# Altium project PenguinPi.PrjPcb
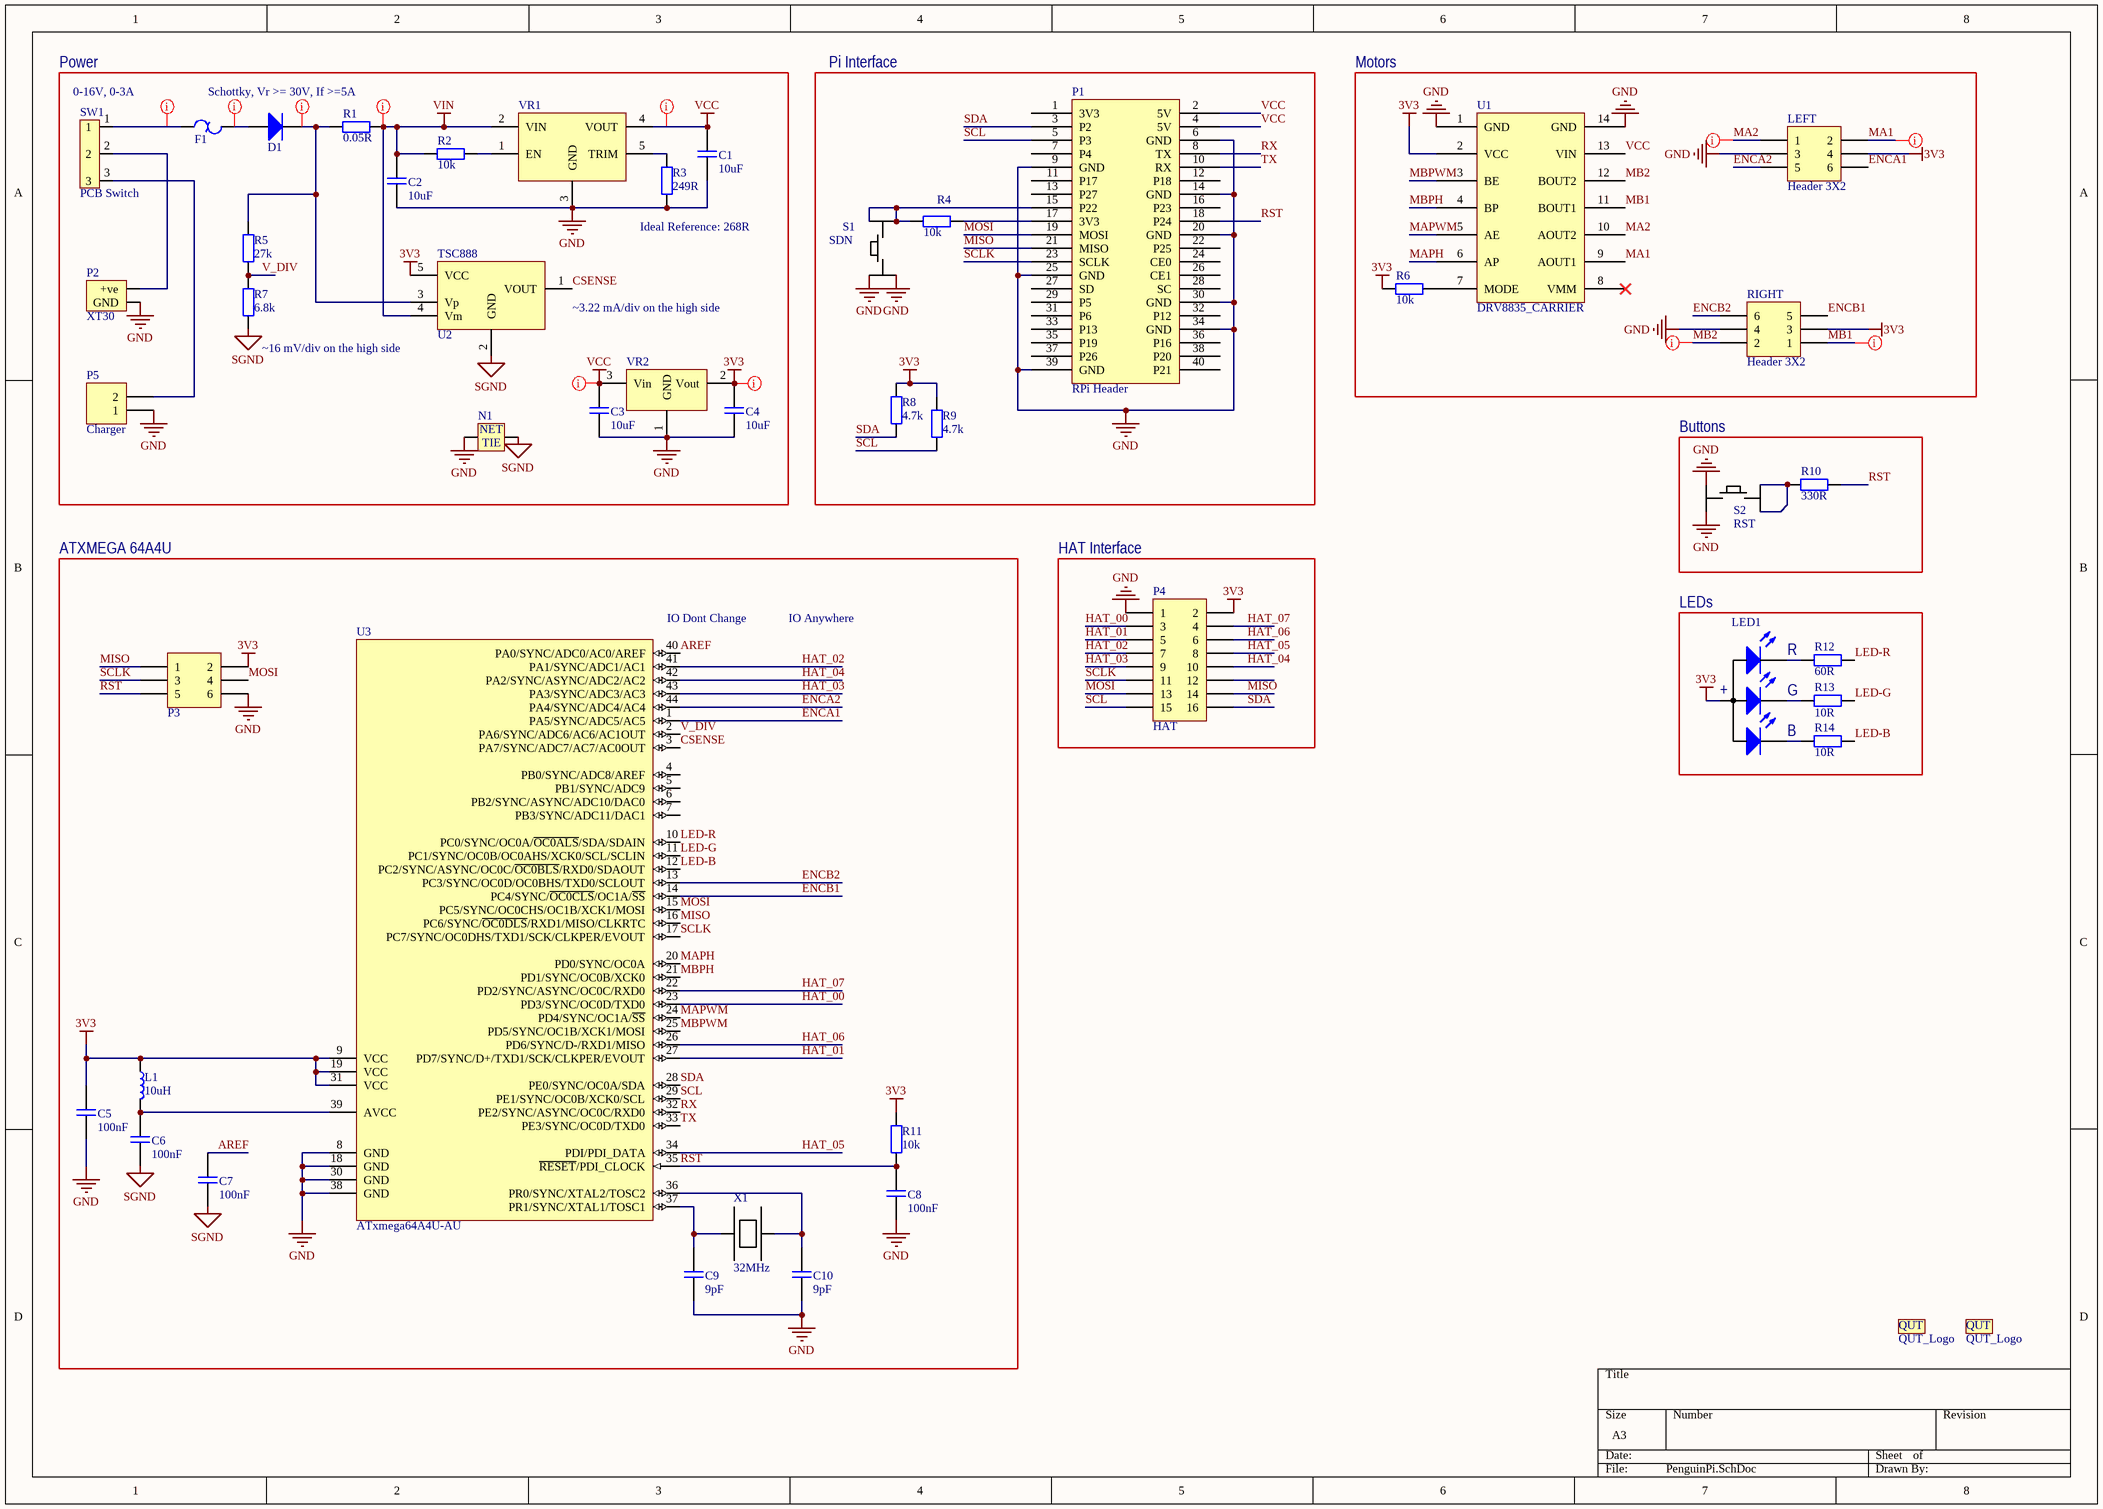
[diagram p0: PenguinPi.SchDoc]
1 sheet, 47 parts. Net scope: global (net labels, ports and power ports of the same name join across sheets).
Board file: PenguinPi.PcbDoc

## Sheet PenguinPi.SchDoc: PenguinPi v2
size A3; DrawnBy: Steven Bulmer; PageSetup: Record=PageOptions|CenterHorizontal=True|CenterVertical=True|PrintScale=1.01|XCorrection=1.00|YCorrection=1.00|PrintKind=1|BorderSize=5000000|LeftOffset=0|BottomOffset=0|Orientation=2|PaperLength=1000|PaperWidth=1000|Scale=100|PaperSource=7|PrintQuality=600|MediaType=1|DitherType=10|PrintScaleMode=1|PaperKind=A3 (297 x 420mm)|PaperIndex=8

### Parts
C1  value 10uF  [CAPC2012X07N]  (hidden comment: CAP SMD)
C2  value 10uF  [CAPC2012X07N]  (hidden comment: CAP SMD)
C3  value 10uF  [CAPC2012X07N]  (hidden comment: CAP SMD)
C4  value 10uF  [CAPC2012X07N]  (hidden comment: CAP SMD)
C5  value 100nF  [CAPC2012X07N]  (hidden comment: CAP SMD)
C6  value 100nF  [CAPC2012X07N]  (hidden comment: CAP SMD)
C7  value 100nF  [CAPC2012X07N]  (hidden comment: CAP SMD)
C8  value 100nF  [CAPC2012X07N]  (hidden comment: CAP SMD)
C9  value 9pF  [CAPC2012X07N]  (hidden comment: CAP SMD)
C10  value 9pF  [CAPC2012X07N]  (hidden comment: CAP SMD)
D1  SMD DIODE  [SODFL470X110-2N]  (value not drawn)
F1  RGEF250  [MF-MSMF250/16X-2]  (value not drawn)
L1  value 10uH  [CM322522]  (hidden comment: INDUCTOR SMD)
LED1  RGB SMD  [RGB SMD]  (value not drawn)
LEFT  Header 3X2  [HDR2X3]
LG1  QUT_Logo  [QUT_Logo]  (no BOM)
LG2  QUT_Logo  [QUT_Logo]  (no BOM)
N1  NETTIE  [NETTIE-SMD-5mil]  (value not drawn)  (net tie, no BOM)
P1  RPi Header  [RPI 2 Header]
P2  XT30  [XT30 - PCB mount]
P3  Header 3x2  [Header 3x2 nonstandard]  (value not drawn)
P4  HAT  [HDR2X8]
P5  Charger  [HDR1X2]
R1  value 0.05R  [RESC3216X06M]  (hidden comment: RES SMD)
R2  value 10k  [RESC2012X07N]  (hidden comment: RES SMD)
R3  value 249R  [RESC2012X07N]  (hidden comment: RES SMD)
R4  value 10k  [RESC2012X07N]  (hidden comment: RES SMD)
R5  value 27k  [RESC2012X07N]  (hidden comment: RES SMD)
R6  value 10k  [RESC2012X07N]  (hidden comment: RES SMD)
R7  value 6.8k  [RESC2012X07N]  (hidden comment: RES SMD)
R8  value 4.7k  [RESC2012X07N]  (hidden comment: RES SMD)
R9  value 4.7k  [RESC2012X07N]  (hidden comment: RES SMD)
R10  value 330R  [RESC2012X07N]  (hidden comment: RES SMD)
R11  value 10k  [RESC2012X07N]  (hidden comment: RES SMD)
R12  value 60R  [RESC2012X07N]  (hidden comment: RES SMD)
R13  value 10R  [RESC2012X07N]  (hidden comment: RES SMD)
R14  value 10R  [RESC2012X07N]  (hidden comment: RES SMD)
RIGHT  Header 3X2  [HDR2X3]
S1  SDN  [E-SWITCH-TL3342]
S2  RST  [E-SWITCH-TL3342]
SW1  PCB Switch  [PCB Switch]
U1  DRV8835_CARRIER  [DRV8835_CARRIER]
U2  TSC888  [SOT95P280X145-5N]
U3  ATxmega64A4U-AU  [44A_L]
VR1  MURATA_OKR-T3-W12C  [MURATA_OKR-Tn]  (value not drawn)
VR2  3V3 LDO  [SOT230P700X180-4N]  (value not drawn)
X1  32MHz  [XTAL AV Series]

### Blocks framed on the sheet
Power: C1-C4 D1 F1 N1 P2 P5 R1-R3 R5 R7 SW1 U2 VR1 VR2
Pi Interface: P1 R4 R8 R9 S1
Motors: LEFT R6 RIGHT U1
Buttons: R10 S2
ATXMEGA 64A4U: C5-C10 L1 P3 R11 U3 X1
HAT Interface: P4
LEDs: LED1 R12-R14

### Nets
3V3: C4.2(K) C5.2(K) L1.1(Anode) LED1.4(A) LEFT.4 P3.2 P4.2 R6.1 R8.2 R9.2 R11.2 RIGHT.3 U1.2(VCC) U2.5(VCC) U3.9(VCC) U3.19(VCC) U3.31(VCC) VR2.2(Vout)
GND: C1.1(A) C2.1(A) C3.1(A) C4.1(A) C5.1(A) C8.1(A) C9.1(A) C10.1(A) LEFT.3 N1.1 P1.6(GND) P1.9(GND) P1.14(GND) P1.20(GND) P1.25(GND) P1.30(GND) P1.34(GND) P1.39(GND) P2.1(GND) P3.6 P4.1 P5.1 R3.1 RIGHT.4 S1.3(B') S1.4(B) S2.1(A) S2.2(A') U1.1(GND) U1.14(GND) U3.8(GND) U3.18(GND) U3.30(GND) U3.38(GND) VR1.3(GND) VR2.1(GND)
SGND: C6.1(A) C7.1(A) N1.2 R7.1 U2.2(GND)
VCC: C1.2(K) C3.2(K) P1.2(5V) P1.4(5V) U1.13(VIN) VR1.4(VOUT) VR2.3(Vin)
VIN: C2.2(K) R1.2 R2.2 U2.4(Vm) VR1.2(VIN)
AREF: C7.2(K) U3.40(PA0/SYNC/ADC0/AC0/AREF)
CSENSE: U2.1(VOUT) U3.3(PA7/SYNC/ADC7/AC7/AC0OUT)
ENCA1: LEFT.6 U3.1(PA5/SYNC/ADC5/AC5)
ENCA2: LEFT.5 U3.44(PA4/SYNC/ADC4/AC4)
ENCB1: RIGHT.5 U3.14(PC4/SYNC/~{OC0CLS}/OC1A/~{SS})
ENCB2: RIGHT.6 U3.13(PC3/SYNC/OC0D/OC0BHS/TXD0/SCLOUT)
HAT_00: P4.3 U3.23(PD3/SYNC/OC0D/TXD0)
HAT_01: P4.5 U3.27(PD7/SYNC/D+/TXD1/SCK/CLKPER/EVOUT)
HAT_02: P4.7 U3.41(PA1/SYNC/ADC1/AC1)
HAT_03: P4.9 U3.43(PA3/SYNC/ADC3/AC3)
HAT_04: P4.10 U3.42(PA2/SYNC/ASYNC/ADC2/AC2)
HAT_05: P4.8 U3.34(PDI/PDI_DATA)
HAT_06: P4.6 U3.26(PD6/SYNC/D-/RXD1/MISO)
HAT_07: P4.4 U3.22(PD2/SYNC/ASYNC/OC0C/RXD0)
LED-B: R14.2 U3.12(PC2/SYNC/ASYNC/OC0C/~{OC0BLS}/RXD0/SDAOUT)
LED-G: R13.2 U3.11(PC1/SYNC/OC0B/OC0AHS/XCK0/SCL/SCLIN)
LED-R: R12.2 U3.10(PC0/SYNC/OC0A/~{OC0ALS}/SDA/SDAIN)
MA1: LEFT.2 U1.9(AOUT1)
MA2: LEFT.1 U1.10(AOUT2)
MAPH: U1.6(AP) U3.20(PD0/SYNC/OC0A)
MAPWM: U1.5(AE) U3.24(PD4/SYNC/OC1A/~{SS})
MB1: RIGHT.1 U1.11(BOUT1)
MB2: RIGHT.2 U1.12(BOUT2)
MBPH: U1.4(BP) U3.21(PD1/SYNC/OC0B/XCK0)
MBPWM: U1.3(BE) U3.25(PD5/SYNC/OC1B/XCK1/MOSI)
MISO: P1.21(MISO) P3.1 P4.14 U3.16(PC6/SYNC/~{OC0DLS}/RXD1/MISO/CLKRTC)
MOSI: P1.19(MOSI) P3.4 P4.13 U3.15(PC5/SYNC/OC0CHS/OC1B/XCK1/MOSI)
RST: C8.2(K) P1.18(P24) P3.5 R10.2 R11.1 U3.35(~{RESET}/PDI_CLOCK)
RX: P1.8(TX) U3.32(PE2/SYNC/ASYNC/OC0C/RXD0)
SCL: P1.5(P3) P4.15 R9.1 U3.29(PE1/SYNC/OC0B/XCK0/SCL)
SCLK: P1.23(SCLK) P3.3 P4.11 U3.17(PC7/SYNC/OC0DHS/TXD1/SCK/CLKPER/EVOUT)
SDA: P1.3(P2) P4.16 R8.1 U3.28(PE0/SYNC/OC0A/SDA)
TX: P1.10(RX) U3.33(PE3/SYNC/OC0D/TXD0)
V_DIV: R5.1 R7.2 U3.2(PA6/SYNC/ADC6/AC6/AC1OUT)
NetC6_2: C6.2(K) L1.2(Cathode) U3.39(AVCC)
NetC9_2: C9.2(K) U3.37(PR1/SYNC/XTAL1/TOSC1) X1.2
NetC10_2: C10.2(K) U3.36(PR0/SYNC/XTAL2/TOSC2) X1.1
NetD1_1: D1.1 F1.2
NetD1_2: D1.2 R1.1 R5.2 U2.3(Vp)
NetF1_1: F1.1 SW1.1
NetLED1_1: LED1.1(K-R) R12.1
NetLED1_2: LED1.2(K-G) R13.1
NetLED1_3: LED1.3(K-B) R14.1
NetP1_15: P1.15(P22) R4.1 S1.1(A) S1.2(A')
NetP1_17: P1.17(3V3) R4.2
NetP2_2: P2.2(+ve) SW1.2
NetP5_2: P5.2 SW1.3
NetR2_1: R2.1 VR1.1(EN)
NetR3_2: R3.2 VR1.5(TRIM)
NetR6_2: R6.2 U1.7(MODE)
NetR10_1: R10.1 S2.3(B') S2.4(B)

Not connected (* = marked no-connect by the designer): P1 1(3V3) 7(P4) 11(P17) 12(P18) 13(P27) 16(P23) 22(P25) 24(CE0) 26(CE1) 27(SD) 28(SC) 29(P5) 31(P6) 32(P12) 33(P13) 35(P19) 36(P16) 37(P26) 38(P20) 40(P21); P4 12; U1 8(VMM)*; U3 4(PB0/SYNC/ADC8/AREF) 5(PB1/SYNC/ADC9) 6(PB2/SYNC/ASYNC/ADC10/DAC0) 7(PB3/SYNC/ADC11/DAC1)

### Layout directives
net class Power: 3V3, MA1, MA2, MB1, MB2, NetD1_1, NetD1_2, NetF1_1, VCC, VIN

### Notes on the sheet
- (near SW1) 0-16V, 0-3A
- Schottky, Vr >= 30V, If >=5A
- Ideal Reference: 268R
- (near U2) ~3.22 mA/div on the high side
- ~16 mV/div on the high side
- (near U3) IO Dont Change
- IO Anywhere
- (in symbol NETTIE) NET; TIE
- (in symbol QUT_Logo) QUT
- (in symbol RGB SMD) R; +; G; B

### Library data of the parts
C1-C10 = CAP SMD: Surface mount capacitor
D1 = SMD DIODE: Surface mount Diode; Supplier: Digikey 1727-5317-1-ND
F1 = RGEF250: PPTC Thermal Fuse; Hold Current: 2.5A; Trip Current: 4.7A; VRating: 16V; Supplier: E14 2519587
L1 = INDUCTOR SMD: Surface Mount Inductor - varying sizes; Supplier: E14 9357866
LED1 = RGB SMD: ASMB-MTB1-0A3A2; Supplier: Digikey 516-3280-1-ND
LEFT RIGHT = Header 3X2: Header, 3-Pin, Dual row; LatestRevisionDate: 17-Jul-2002; LatestRevisionNote: Re-released for DXP Platform.; Publisher: Altium Limited
P1 = RPi 2 Header: GPIO connector for Raspberry Pi Microcomputer
P3 = Header 3x2 Staggered: 3 by 2 header, staggered pin arrangement
P4 = Header 8X2: Header, 8-Pin, Dual row; LatestRevisionDate: 17-Jul-2002; LatestRevisionNote: Re-released for DXP Platform.; Publisher: Altium Limited
P5 = Header 2: Header, 2-Pin; LatestRevisionDate: 17-Jul-2002; LatestRevisionNote: Re-released for DXP Platform.; Publisher: Altium Limited
R1-R14 = RES SMD: 0805 surface mount resistor
S1 S2 = E-SWITCH-PUSHBUTTON: TL 3342 surface mount pushbutton
  S1: Supplier: Digikey EG2531CT-ND
U1 = DRV8835_CARRIER: DRV8835 Motor Controller
U2 = TSC888: Curent Sense Amplifier
U3 = CMP-0094-00068-2: 8/16-bit AVR XMEGA A4U Microcontroller, 1.6-3.6V, 32MHz, 64K + 4KB Flash, 2K EEPROM, 4K SRAM, 44-pin TQFP, Industrial Grade (-40°C to 85°C); Manufacturer: Atmel; RevisionNote: Pin10ä¸­OC0ALSåŠ barï¼ŒåŠ ä¸ŠSDAIN;Pin11åŠ ä¸ŠSCLIN;Pin12ä¸­OC0BLSåŠ barï¼ŒåŠ ä¸ŠSDAOUT;Pin13åŠ ä¸ŠSCLOUT;Pin14ä¸­OC0CLSåŠ barï¼›Pin16ä¸­OC0DLSåŠ barï¼Œclkå¤§å†™ï¼›Pin17ä¸­clkå¤§å†™ï¼›Pin27ä¸­clkå¤§å†™ï¼›çŸ©å½¢æ¡†ç¼©çŸ­; ComponentLink2URL: http://www.atmel.com/Images/Atmel-8387-8-and16-bit-AVR-Microcontroller-XMEGA-A4U_Datasheet.pdf; PackageDescription: 44-Pin Plastic Thin Profile Quad Flat Pack, 10 x 10 x 1.0 mm Body, 0.8 mm Pitch (TQFP); Code_JEDEC: MS-026-ACB; ComponentLink1Description: Manufacturer URL; PartNumber: ATxmega64A4U-AU; ComponentLink2Description: Datasheet; ComponentLink1URL: http://www.atmel.com/; DatasheetVersion: revF, Jan-2014; PackageVersion: revC, Oct-2010; PackageReference: 44A; Supplier: Digikey ATXMEGA64A4U-AU-ND
VR1 = MURATA_OKR-T3-W12C: 5V 3A switching voltage regulator; Supplier: Digikey 811-2115-5-ND
VR2 = 3V3 LDO: 3.3 V Low Dropout Regulator; Part Number: *
X1 = XTAL: Man Part No: X1E0000210162; Supplier: E14 1712845
SW1 = PCB Switch: Supplier: Digikey CKN5005-ND